# Altium schematic sheet 09_Mech.SchDoc
size A4; SheetNumber: 10; SheetTotal: 10
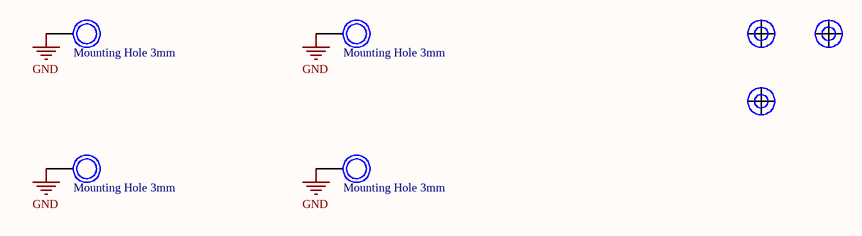
[diagram p0: 09_Mech.SchDoc]

## Parts
*1  Fiducials 1:2  [Fiducials 1:2]  (value not drawn)  (part A of 3)
*2  Fiducials 1:2  [Fiducials 1:2]  (value not drawn)  (part A of 3)
*3  Fiducials 1:2  [Fiducials 1:2]  (value not drawn)  (part A of 3)
H1  Mounting Hole 3mm  [3mm with via]
H2  Mounting Hole 3mm  [3mm with via]
H3  Mounting Hole 3mm  [3mm with via]
H4  Mounting Hole 3mm  [3mm with via]

## Nets

Not connected (* = marked no-connect by the designer): H1 0; H2 0; H3 0; H4 0

## Notes on the sheet
- Labels drawn without touching a wire or pin: GND
- APPROVALS
- DATE
- PROJECT
- BOM:
- REFERENCE DOCUMENTS
- TITLE
- PROJECT REVISION
- DOCUMENT REVISION
- ASSY DWG:
- FAB DWG:
- PCB DWG:
- SIZE:
- A4
- FILE NAME:
- REV
- SHEET
- OF